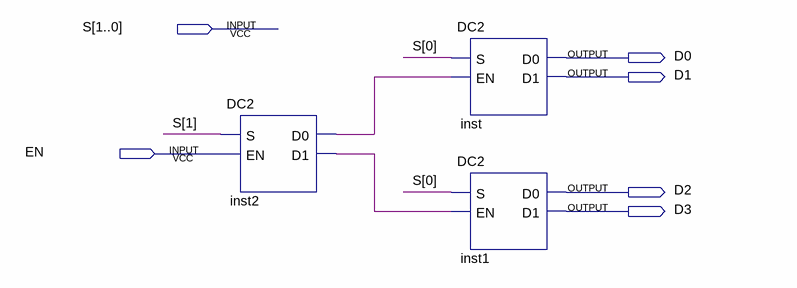
[diagram p0: schematic sheet]
// Quartus schematic DC4.bdf as structural Verilog: 3 symbols, 6 pins
module DC4 (
  input  [1:0] S,
  input  EN,
  output D0,
  output D1,
  output D2,
  output D3
);

  wire inst2_d0, inst2_d1;

  DC2 inst2 (.S(S[1]), .EN(EN), .D0(inst2_d0), .D1(inst2_d1));
  DC2 inst (.S(S[0]), .EN(inst2_d0), .D0(D0), .D1(D1));
  DC2 inst1 (.S(S[0]), .EN(inst2_d1), .D0(D2), .D1(D3));
endmodule
